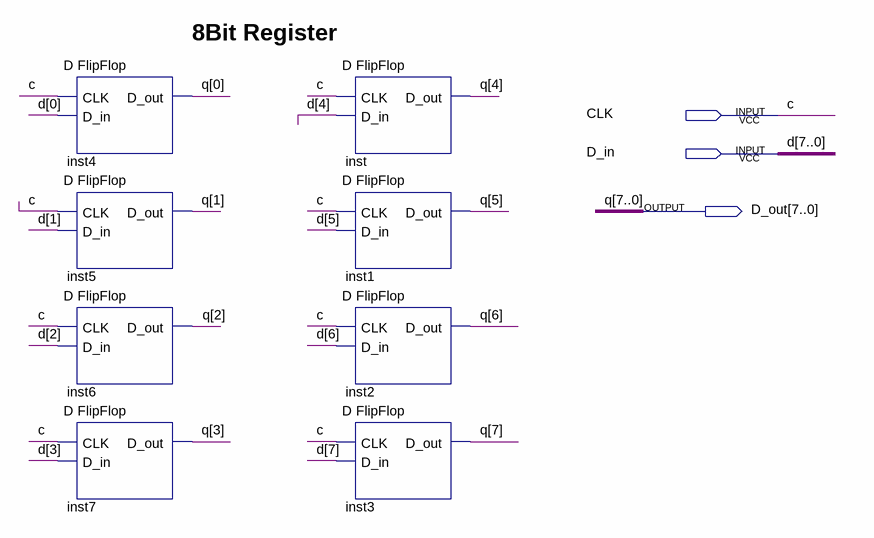
[diagram p0: schematic sheet]
// Quartus schematic 8bit Register.bdf as structural Verilog: 8 symbols, 3 pins
module \8bit_Register  (
  input  CLK,
  input  D_in,
  output [7:0] D_out
);

  wire [7:0] d;

  \D_FlipFlop  inst4 (.CLK(CLK), .D_in(d[0]), .D_out(D_out[0]));
  \D_FlipFlop  inst5 (.CLK(CLK), .D_in(d[1]), .D_out(D_out[1]));
  \D_FlipFlop  inst6 (.CLK(CLK), .D_in(d[2]), .D_out(D_out[2]));
  \D_FlipFlop  inst7 (.CLK(CLK), .D_in(d[3]), .D_out(D_out[3]));
  \D_FlipFlop  inst (.CLK(CLK), .D_in(d[4]), .D_out(D_out[4]));
  \D_FlipFlop  inst1 (.CLK(CLK), .D_in(d[5]), .D_out(D_out[5]));
  \D_FlipFlop  inst2 (.CLK(CLK), .D_in(d[6]), .D_out(D_out[6]));
  \D_FlipFlop  inst3 (.CLK(CLK), .D_in(d[7]), .D_out(D_out[7]));

  // Other names for the same wires on the sheet: c = CLK; q[7:0] = D_out

  // Notes on the sheet:
  //   8Bit Register
endmodule
